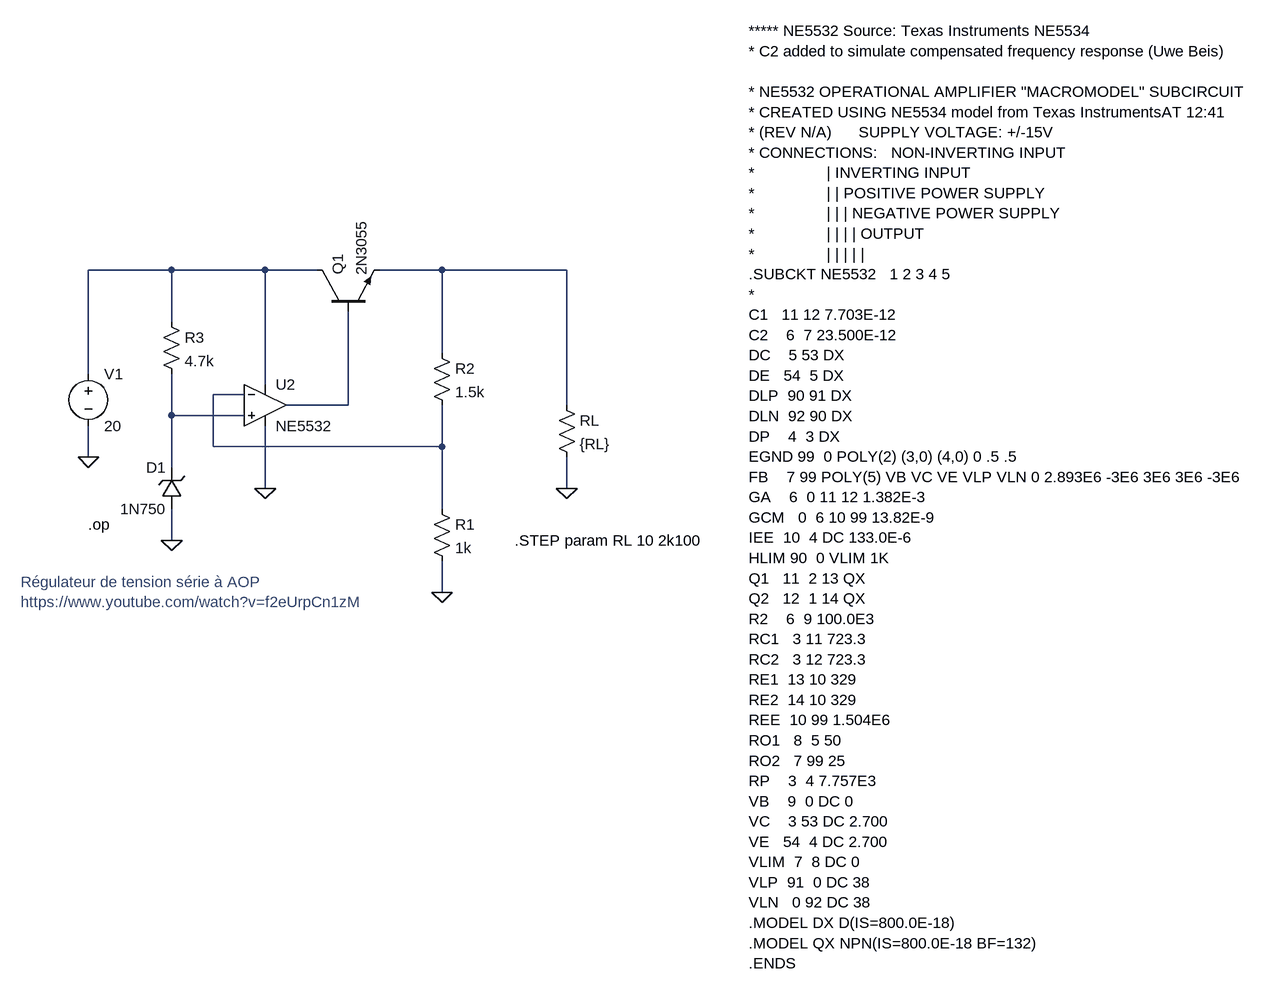
[diagram p0: schematic Regul-AOP01.asc]
Regul-AOP01.asc, the LTspice schematic file:
Version 4.1
SHEET 1 1812 920
WIRE 128 -16 0 -16
WIRE 272 -16 128 -16
WIRE 352 -16 272 -16
WIRE 544 -16 448 -16
WIRE 736 -16 544 -16
WIRE 128 64 128 -16
WIRE 544 112 544 -16
WIRE 0 144 0 -16
WIRE 272 160 272 -16
WIRE 240 176 192 176
WIRE 400 192 400 48
WIRE 400 192 304 192
WIRE 736 192 736 -16
WIRE 128 208 128 144
WIRE 240 208 128 208
WIRE 192 256 192 176
WIRE 544 256 544 192
WIRE 544 256 192 256
WIRE 0 272 0 224
WIRE 128 288 128 208
WIRE 272 320 272 224
WIRE 736 320 736 272
WIRE 544 352 544 256
WIRE 128 400 128 352
WIRE 544 480 544 432
FLAG 0 272 0
FLAG 128 400 0
FLAG 544 480 0
FLAG 736 320 0
FLAG 272 320 0
SYMBOL voltage 0 128 R0
WINDOW 123 0 0 Left 0
WINDOW 39 0 0 Left 0
SYMATTR InstName V1
SYMATTR Value 20
SYMBOL npn 352 48 R270
SYMATTR InstName Q1
SYMATTR Value 2N3055
SYMBOL zener 144 352 R180
WINDOW 0 24 64 Left 2
WINDOW 3 24 0 Left 2
SYMATTR InstName D1
SYMATTR Value 1N750
SYMBOL res 112 48 R0
SYMATTR InstName R3
SYMATTR Value 4.7k
SYMBOL res 528 96 R0
SYMATTR InstName R2
SYMATTR Value 1.5k
SYMBOL res 528 336 R0
SYMATTR InstName R1
SYMATTR Value 1k
SYMBOL res 720 176 R0
SYMATTR InstName RL
SYMATTR Value {RL}
SYMBOL OpAmps\\opamp2 272 128 R0
SYMATTR InstName U2
SYMATTR Value NE5532
TEXT 0 376 Left 2 !.op
TEXT 656 400 Left 2 !.STEP param RL 10 2k100
TEXT 1016 -384 Left 2 !***** NE5532 Source: Texas Instruments NE5534\n* C2 added to simulate compensated frequency response (Uwe Beis)\n \n* NE5532 OPERATIONAL AMPLIFIER "MACROMODEL" SUBCIRCUIT\n* CREATED USING NE5534 model from Texas InstrumentsAT 12:41\n* (REV N/A)      SUPPLY VOLTAGE: +/-15V\n* CONNECTIONS:   NON-INVERTING INPUT\n*                | INVERTING INPUT\n*                | | POSITIVE POWER SUPPLY\n*                | | | NEGATIVE POWER SUPPLY\n*                | | | | OUTPUT\n*                | | | | |\n.SUBCKT NE5532   1 2 3 4 5\n*\nC1   11 12 7.703E-12\nC2    6  7 23.500E-12\nDC    5 53 DX\nDE   54  5 DX\nDLP  90 91 DX\nDLN  92 90 DX\nDP    4  3 DX\nEGND 99  0 POLY(2) (3,0) (4,0) 0 .5 .5\nFB    7 99 POLY(5) VB VC VE VLP VLN 0 2.893E6 -3E6 3E6 3E6 -3E6\nGA    6  0 11 12 1.382E-3\nGCM   0  6 10 99 13.82E-9\nIEE  10  4 DC 133.0E-6\nHLIM 90  0 VLIM 1K\nQ1   11  2 13 QX\nQ2   12  1 14 QX\nR2    6  9 100.0E3\nRC1   3 11 723.3\nRC2   3 12 723.3\nRE1  13 10 329\nRE2  14 10 329\nREE  10 99 1.504E6\nRO1   8  5 50\nRO2   7 99 25\nRP    3  4 7.757E3\nVB    9  0 DC 0\nVC    3 53 DC 2.700\nVE   54  4 DC 2.700\nVLIM  7  8 DC 0\nVLP  91  0 DC 38\nVLN   0 92 DC 38\n.MODEL DX D(IS=800.0E-18)\n.MODEL QX NPN(IS=800.0E-18 BF=132)\n.ENDS
TEXT -104 464 Left 2 ;Régulateur de tension série à AOP\nhttps://www.youtube.com/watch?v=f2eUrpCn1zM

The netlist it stands for:
* Regul-AOP01.asc
V1 N001 0 20
Q1 N001 N004 N002 0 2N3055
D1 0 N005 1N750
R3 N001 N005 4.7k
R2 N002 N003 1.5k
R1 N003 0 1k
RL N002 0 {RL}
X§U2 N005 N003 N001 0 N004 NE5532  ; pins In+ In- V+ V- OUT
.model D D
.lib standard.dio
.model NPN NPN
.model PNP PNP
.lib standard.bjt
.op
.STEP param RL 10 2k100
***** NE5532 Source: Texas Instruments NE5534
* C2 added to simulate compensated frequency response (Uwe Beis)
* NE5532 OPERATIONAL AMPLIFIER "MACROMODEL" SUBCIRCUIT
* CREATED USING NE5534 model from Texas InstrumentsAT 12:41
* (REV N/A)      SUPPLY VOLTAGE: +/-15V
* CONNECTIONS:   NON-INVERTING INPUT
*                | INVERTING INPUT
*                | | POSITIVE POWER SUPPLY
*                | | | NEGATIVE POWER SUPPLY
*                | | | | OUTPUT
*                | | | | |
.SUBCKT NE5532   1 2 3 4 5
*
C1   11 12 7.703E-12
C2    6  7 23.500E-12
DC    5 53 DX
DE   54  5 DX
DLP  90 91 DX
DLN  92 90 DX
DP    4  3 DX
EGND 99  0 POLY(2) (3,0) (4,0) 0 .5 .5
FB    7 99 POLY(5) VB VC VE VLP VLN 0 2.893E6 -3E6 3E6 3E6 -3E6
GA    6  0 11 12 1.382E-3
GCM   0  6 10 99 13.82E-9
IEE  10  4 DC 133.0E-6
HLIM 90  0 VLIM 1K
Q1   11  2 13 QX
Q2   12  1 14 QX
R2    6  9 100.0E3
RC1   3 11 723.3
RC2   3 12 723.3
RE1  13 10 329
RE2  14 10 329
REE  10 99 1.504E6
RO1   8  5 50
RO2   7 99 25
RP    3  4 7.757E3
VB    9  0 DC 0
VC    3 53 DC 2.700
VE   54  4 DC 2.700
VLIM  7  8 DC 0
VLP  91  0 DC 38
VLN   0 92 DC 38
.MODEL DX D(IS=800.0E-18)
.MODEL QX NPN(IS=800.0E-18 BF=132)
.ENDS
* Régulateur de tension série à AOP
* https://www.youtube.com/watch?v=f2eUrpCn1zM
.backanno
.end